# Altium schematic sheet [5]-CONNECTORS.SchDoc
size A4
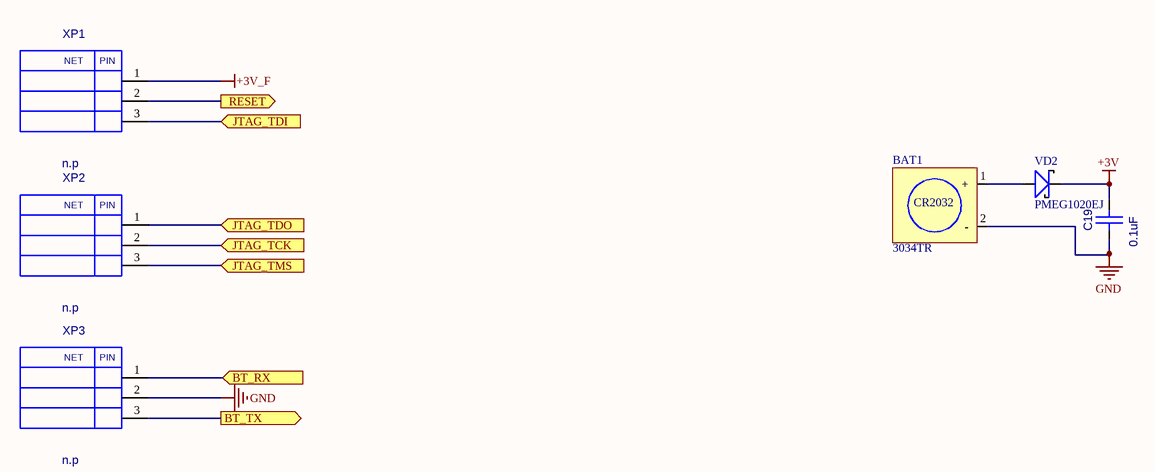
[diagram p0: [5]-CONNECTORS.SchDoc]

## Parts
BAT1  3034TR  [3034-TR]
C19  0.1uF  [CC0603]
VD2  PMEG1020EJ  [SOD323]
XP1  n.p  [PLS-03]
XP2  n.p  [PLS-03]
XP3  n.p  [PLS-03]

## Ports
BT_RX (in), BT_TX (out), JTAG_TCK (in), JTAG_TDI (in), JTAG_TDO (in), JTAG_TMS (in), RESET (out)

## Nets
+3V: C19.2(B) VD2.2(K)
+3V_F: XP1.1
GND: BAT1.2(-) C19.1(A) XP3.2
BT_RX: XP3.1 ; port BT_RX
BT_TX: XP3.3 ; port BT_TX
JTAG_TCK: XP2.2 ; port JTAG_TCK
JTAG_TDI: XP1.3 ; port JTAG_TDI
JTAG_TDO: XP2.1 ; port JTAG_TDO
JTAG_TMS: XP2.3 ; port JTAG_TMS
RESET: XP1.2 ; port RESET
NetBAT1_1: BAT1.1(+) VD2.1(A)

## Notes on the sheet
- (in symbol 3034) CR2032
- (in symbol PLS03) NET; PIN

## Library data of the parts
BAT1 = 3034: CR2032 holder smd; Value: 3034TR
C19 = CC0603: Value: 0.1uF
VD2 = PMEG2010: Value: PMEG1020EJ
XP1-XP3 = PLS03: Value: *